# Altium schematic sheet DCDC.SchDoc: DC/DC Module
size 420 x 297 mm; Date: 12/02/24; DrawnBy: Georgios Papandreou; Revision: 3; SheetNumber: 1; SheetTotal: 1; CarNum: E5; Currentsheet: 1; Totalsheet: 1
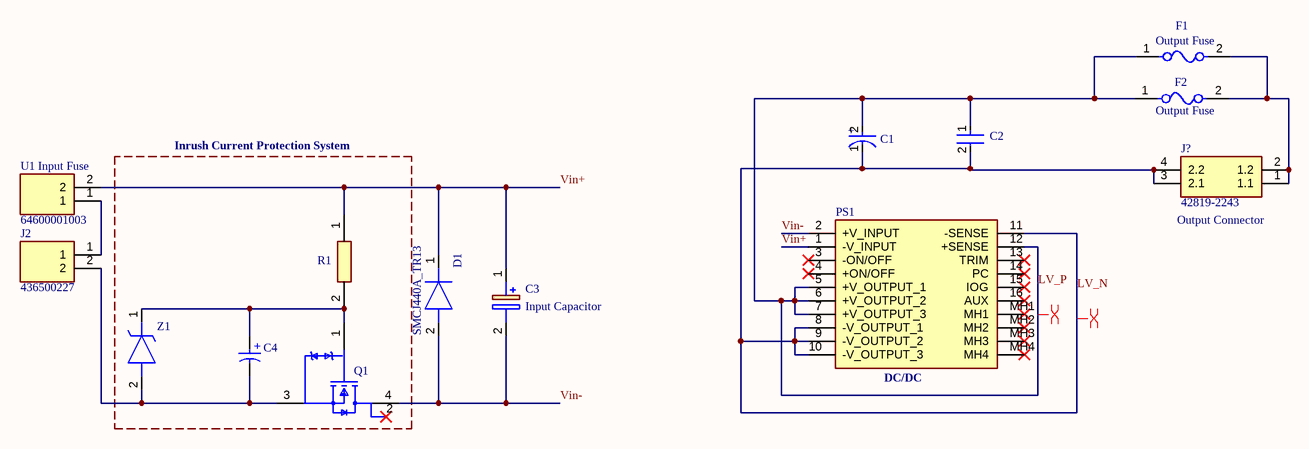
[diagram p0: DCDC.SchDoc]

## Parts
C1  MAL215371101E3  [FP-MAL215371101E3-MFG]  (value not drawn)
C2  C1210C476M4PACTU  [FP-C1210C476M4PACTU-MFG]  (value not drawn)
C3  LLG2W331MELA45  [CAPPRD1000W180D2575H4700]  (value not drawn)
C4  860021380020  [WCAP-ATG5_D16H31.5]  (value not drawn)
D1  SMCJ440A_TR13  [DIOM7959X280N]
F1  178.6165.0002  [FP-178_6165-MFG]  (value not drawn)
F2  178.6165.0002  [FP-178_6165-MFG]  (value not drawn)
J2  436500227  [4365002YY_272829]
J?  42819-2243  [42819-2XXY_2]
PS1  CFB600-300S24  [CFB600300S24]  (value not drawn)
Q1  STN3N45K3  [FP-SOT-223-0046067-MFG]  (value not drawn)
R1  CRCW2010200KFKEFHP  [RESC5025X70N]  (value not drawn)
U1  64600001003  [64600001003]
Z1  KDZLV62  [KDZLV110]  (value not drawn)

## Blocks framed on the sheet
Inrush Current Protection System: C4 Q1 R1 Z1

## Nets
LV_N: C1.1(C) C2.2 J?.3(2.1) J?.4(2.2) PS1.8(-V_OUTPUT_1) PS1.9(-V_OUTPUT_2) PS1.10(-V_OUTPUT_3) PS1.11(-SENSE)
LV_P: C1.2(A) C2.1 F1.1 F2.1 PS1.5(+V_OUTPUT_1) PS1.6(+V_OUTPUT_2) PS1.7(+V_OUTPUT_3) PS1.12(+SENSE)
Vin+: C3.1(+) D1.1(K) PS1.1(-V_INPUT) R1.1 U1.2
Vin-: C3.2(-) D1.2(A) PS1.2(+V_INPUT) Q1.4(D)
NetC4_1: C4.1(P) Q1.1(G) R1.2 Z1.1(K)
NetC4_2: C4.2(N) J2.2 Q1.3(S) Z1.2(A)
NetF1_2: F1.2 F2.2 J?.1(1.1) J?.2(1.2)
NetJ2_1: J2.1 U1.1

Not connected (* = marked no-connect by the designer): PS1 3(-ON/OFF)* 4(+ON/OFF)* 13(TRIM)* 14(PC)* 15(IOG)* 16(AUX)* MH1* MH2* MH3* MH4*; Q1 2(D)*

## Layout directives
differential pair: LV_N, LV_P

## Notes on the sheet
- (near F1) Output Fuse
- (near U1) Input Fuse
- (near F2) Output Fuse
- (near J?) Output Connector
- (near C3) Input Capacitor
- (near PS1) DC/DC
- TITLE
- DATE
- DRAWN BY
- CAR NUMBER
- SIZE
- REV
- SHEET
- A3
- /
- (in symbol CMP-02412-000013-1) +
- (in symbol CMP-207834-000009-2) +

## Library data of the parts
C1 = CMP-02412-000013-1: CAP ALUM 100UF 20% 50V SMD; Dielectric Material: Aluminium; Polarity: Polar; Ripple Current (AC): 320mA; ESR (Equivalent Series Resistance): 300mR; Life (Hours): 3000Hour; Packaging: Tape and Reel; Voltage Rating (DC): 50V; Series: 153 CRV; RoHS Compliant: Yes; Mount: Surface Mount; Radiation Hardening: No; Capacitance: 100uF; Diameter: 10mm; Case/Package: Radial; Lead Free: Lead Free; Height - Seated (Max): 0.413inch; Voltage Rating: 50V; Max Operating Temperature: 105°C; Package Quantity: 500; Min Operating Temperature: -55°C; Height: 10mm; Ripple Current: 320mA; Tolerance: 20%; Contact Plating: Tin; Construction: Cylindrical; Termination: SMD/SMT; Number of Pins: 2
C2 = CMP-2000-06020-2: CAP CER 47UF 16V X5R 1210; Tolerance: 20%; Dissipation Factor: 10%; Dielectric Material: Ceramic; Dielectric: X5R; Capacitance: 47uF; Packaging: Tape and Reel; Length: 3.2mm; Mount: Surface Mount; Max Operating Temperature: 85°C; Series: C; Case Code (Imperial): 1210; Depth: 2.5mm; Thickness: 0.11inch; Radiation Hardening: No; Width: 0.098inch; Lead Free: Lead Free; Case Code (Metric): 3225; Voltage: 16V; Voltage Rating: 16V; Voltage Rating (DC): 16V; Case/Package: 1210; Min Operating Temperature: -55°C; REACH SVHC: No SVHC; Number of Pins: 2; Termination: SMD/SMT; RoHS Compliant: Yes; Contact Plating: Tin; Package Quantity: 1; Height: 2.5mm
C3 = LLG2W331MELA45: Capacitor Polarised; Manufacturer_Name: Nichicon; Datasheet Link: https://componentsearchengine.com/Datasheets/1/LLG2W331MELA45.pdf; Height: 47mm; Manufacturer_Part_Number: LLG2W331MELA45; Mouser Part Number: 647-LLG2W331MELA45; Mouser Price/Stock: https://www.mouser.com/Search/Refine.aspx?Keyword=647-LLG2W331MELA45
C4 = CMP-207834-000009-2: CAP ALUM 100UF 20% 400V RADIAL; NexarPartId: 54007326; Ripple Current: 520mA; Leakage Current: 1.2mA; Life (Hours): 2000hours; Capacitance: 100µF; Pitch: 7.5mm; Polarity: Polar; Dissipation Factor: 15%; Diameter: 16mm; Lead Pitch: 7.493mm; Height: 31.5mm; Height - Seated (Max): 32.9946mm; Voltage Rating: 400V; Packaging: Tape & Box (TB); RoHS: Compliant; Tolerance: 20%; Mount: Through Hole; Min Operating Temperature: -25°C; REACH SVHC: Unknown; Case/Package: Radial; Length: 31.5mm; Voltage Rating (DC): 400V; Max Operating Temperature: 105°C
D1 = SMCJ440A_TR13: Diode; Manufacturer_Name: YAGEO; Manufacturer_Part_Number: SMCJ440A/TR13; Datasheet Link: https://componentsearchengine.com/Datasheets/2/SMCJ440A_TR13.pdf; Height: 2.8mm; Mouser Part Number: 603-SMCJ440A/TR13; Mouser Price/Stock: https://www.mouser.co.uk/ProductDetail/YAGEO/SMCJ440A-TR13?qs=PzGy0jfpSMvGLgltNRkuCg%3D%3D
F1 F2 = CMP-08604-000022-1: FUSE HOLDER BLADE 80V PCB; Manufacturer: Littelfuse; Standoff Height: 1mm; Number Of Fuses: 1; Conn Orientation: Vertical; Device Class L1: Circuit Protection; Height: 17.5mm; Mouser Description: Fuse Holder FLR (ATO) PCB 4-pin Holder; Device Class L3: unset; Lead Free: Yes; Digikey Description: FUSE HOLDER BLADE 80V PCB; Voltage Rating Ac: 80V; ComponentLink2Description: Datasheet; Manufacturer Part Number: 178.6165.0002; Voltage Rating Dc: 80V; Automotive: No; Octopart: https://octopart.com/178.6165.0002-littelfuse-13138759; Device Class L2: Fuse Holders; Package: 178.6165; RoHS: TRUE; ComponentLink2URL: https://www.littelfuse.com/~/media/commercial-vehicle/datasheets/automotive-fuse-holders/ato/littelfuse-fuse-holder-ato-flr-pcb-datasheet.pdf; Category: Fuse
J2 = 436500227: Connector; Manufacturer_Name: Molex; Datasheet Link: https://www.molex.com/pdm_docs/sd/436500227_sd.pdf; Height: 9.9mm; Manufacturer_Part_Number: 436500227
J? = 42819-2243: Connector; Manufacturer_Name: Molex; Datasheet Link: https://www.molex.com/pdm_docs/sd/428192214_sd.pdf; Height: 21mm; Manufacturer_Part_Number: 42819-2243; Mouser Part Number: 538-42819-2243; Mouser Price/Stock: https://www.mouser.com/Search/Refine.aspx?Keyword=538-42819-2243
PS1 = CFB600-300S24: Power Supply; Manufacturer_Name: Cincon; Datasheet Link: https://www.cincon.com.tw/productdownload/SPEC-CFB600W-110S%20series%20V10.pdf; Height: 12.7mm; Manufacturer_Part_Number: CFB600-300S24; Mouser Part Number: 418-CFB600-300S24; Mouser Price/Stock: https://www.mouser.co.uk/ProductDetail/Cincon/CFB600-300S24?qs=UPLqB4C8V4FDbCNWWjqKEg%3D%3D
Q1 = CMP-12198-000029-1: MOSFET N-CH 450V 0.6A SOT-223; Gate to Source Voltage (Vgs): 30V; Threshold Voltage: 3.75V; Input Capacitance: 150pF; Number of Elements: 1; On-State Resistance: 3.8R; Element Configuration: Single; Continuous Drain Current (ID): 600mA; Power Dissipation: 2W; Max Operating Temperature: 150°C; Radiation Hardening: No; Width: 3.7mm; Mount: Surface Mount; Length: 6.7mm; Case/Package: SOT-223; Min Operating Temperature: -55°C; Number of Pins: 4; Drain to Source Breakdown Voltage: 450V; Lead Free: Lead Free; Packaging: Tape and Reel; Package Quantity: 1; Height: 1.8mm; Drain to Source Resistance: 3.8R; Drain to Source Voltage (Vdss): 450V; Max Power Dissipation: 2W; Rds On Max: 3.8R; REACH SVHC: No SVHC
R1 = CRCW2010200KFKEFHP: Resistor; Manufacturer_Name: Vishay; Datasheet Link: https://www.mouser.at/datasheet/2/427/crcwhpe3-1713858.pdf; Height: 0.7mm; Manufacturer_Part_Number: CRCW2010200KFKEFHP; Mouser Part Number: 71-CRCW2010200KFKEFH; Mouser Price/Stock: https://www.mouser.co.uk/ProductDetail/Vishay-Dale/CRCW2010200KFKEFHP?qs=40TFAHZMFvfjgaRhi0IFFA%3D%3D
U1 = 64600001003: Undefined or Miscellaneous; Manufacturer_Name: LITTELFUSE; Datasheet Link: https://www.littelfuse.com/~/media/electronics/datasheets/fuse_blocks/littelfuse_fuse_block_646_datasheet.pdf.pdf; Height: 12mm; Manufacturer_Part_Number: 64600001003; Mouser Part Number: 576-64600001003; Mouser Price/Stock: https://www.mouser.co.uk/ProductDetail/Littelfuse/64600001003?qs=J2dJc02fMkr9fpR3CPjt3Q%3D%3D; Arrow Part Number: 64600001003; Arrow Price/Stock: https://www.arrow.com/en/products/64600001003/littelfuse?region=europe
Z1 = KDZLV62: Zener Diode; Manufacturer_Name: ROHM Semiconductor; Datasheet Link: https://fscdn.rohm.com/en/products/databook/datasheet/discrete/diode/zener/kdzlvtr62-e.pdf; Height: 0.8mm; Manufacturer_Part_Number: KDZLV62; Mouser Part Number: N/A; Mouser Price/Stock: https://www.mouser.co.uk/ProductDetail/ROHM-Semiconductor/KDZLV62?qs=tlR8i4ZVbUdWvXwciVMM5g%3D%3D